# EAGLE schematic AVRI2CIO (EAGLE 6.2)
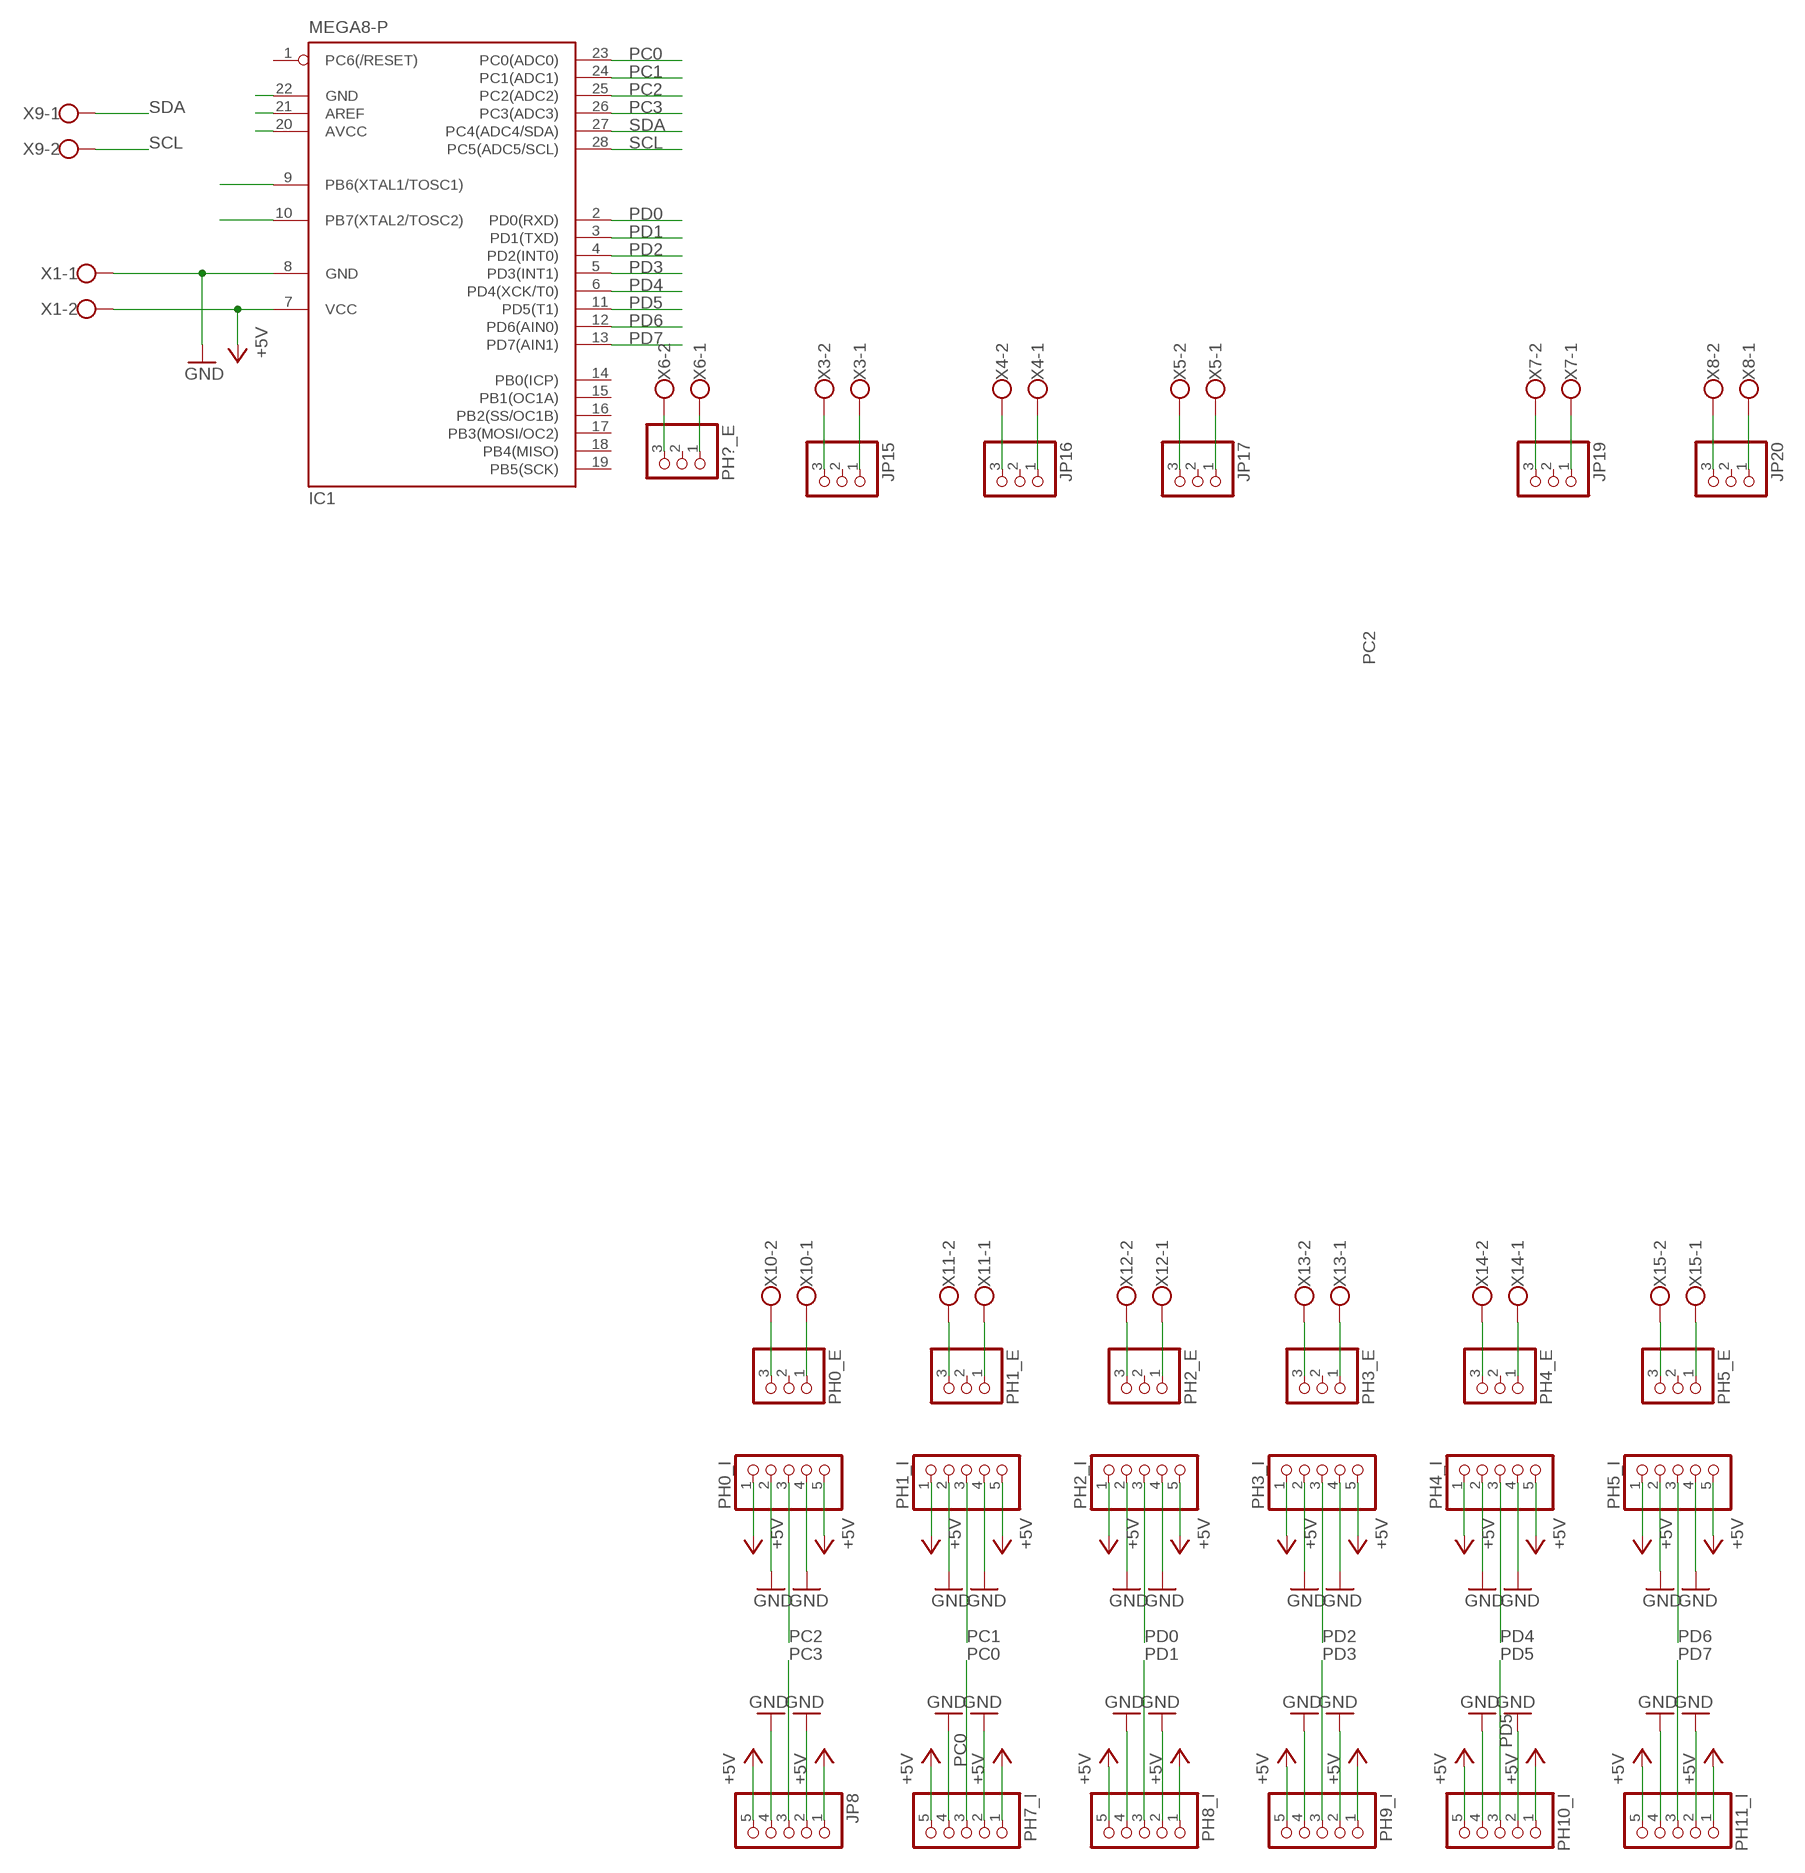
[diagram p0: schematic, sheet 1]

## Parts
IC1  MEGA8-P  [DIL28-3]
JP8  PINHD-1X5  [1X05]
JP15  PINHD-1X3  [1X03]
JP16  PINHD-1X3  [1X03]
JP17  PINHD-1X3  [1X03]
JP19  PINHD-1X3  [1X03]
JP20  PINHD-1X3  [1X03]
PH0_E  PINHD-1X3  [1X03]
PH0_I  PINHD-1X5  [1X05]
PH1_E  PINHD-1X3  [1X03]
PH1_I  PINHD-1X5  [1X05]
PH2_E  PINHD-1X3  [1X03]
PH2_I  PINHD-1X5  [1X05]
PH3_E  PINHD-1X3  [1X03]
PH3_I  PINHD-1X5  [1X05]
PH4_E  PINHD-1X3  [1X03]
PH4_I  PINHD-1X5  [1X05]
PH5_E  PINHD-1X3  [1X03]
PH5_I  PINHD-1X5  [1X05]
PH7_I  PINHD-1X5  [1X05]
PH8_I  PINHD-1X5  [1X05]
PH9_I  PINHD-1X5  [1X05]
PH10_I  PINHD-1X5  [1X05]
PH11_I  PINHD-1X5  [1X05]
PH?_E  PINHD-1X3  [1X03]
X1  W237-102  [W237-102]
X3  W237-102  [W237-102]
X4  W237-102  [W237-102]
X5  W237-102  [W237-102]
X6  W237-102  [W237-102]
X7  W237-102  [W237-102]
X8  W237-102  [W237-102]
X9  W237-102  [W237-102]
X10  W237-102  [W237-102]
X11  W237-102  [W237-102]
X12  W237-102  [W237-102]
X13  W237-102  [W237-102]
X14  W237-102  [W237-102]
X15  W237-102  [W237-102]

## Nets
+5V: IC1.7(VCC) JP8.1 JP8.5 PH0_I.1 PH0_I.5 PH1_I.1 PH1_I.5 PH2_I.1 PH2_I.5 PH3_I.1 PH3_I.5 PH4_I.1 PH4_I.5 PH5_I.1 PH5_I.5 PH7_I.1 PH7_I.5 PH8_I.1 PH8_I.5 PH9_I.1 PH9_I.5 PH10_I.1 PH10_I.5 PH11_I.1 PH11_I.5 X1.2
GND: IC1.8(GND) JP8.2 JP8.4 PH0_I.2 PH0_I.4 PH1_I.2 PH1_I.4 PH2_I.2 PH2_I.4 PH3_I.2 PH3_I.4 PH4_I.2 PH4_I.4 PH5_I.2 PH5_I.4 PH7_I.2 PH7_I.4 PH8_I.2 PH8_I.4 PH9_I.2 PH9_I.4 PH10_I.2 PH10_I.4 PH11_I.2 PH11_I.4 X1.1
IO1: IC1.9(PB6(XTAL1/TOSC1))
IO13: IC1.10(PB7(XTAL2/TOSC2))
N$1: PH0_E.3 X10.2
N$3: JP15.3 X3.2
N$4: JP15.1 X3.1
N$5: JP16.3 X4.2
N$6: JP16.1 X4.1
N$7: JP17.3 X5.2
N$8: JP17.1 X5.1
N$9: PH?_E.3 X6.2
N$10: PH?_E.1 X6.1
N$11: JP19.3 X7.2
N$12: JP19.1 X7.1
N$13: JP20.3 X8.2
N$14: JP20.1 X8.1
N$15: IC1.22(GND)
N$16: IC1.21(AREF)
N$17: PH0_E.1 X10.1
N$19: PH1_E.1 X11.1
N$20: PH1_E.3 X11.2
N$23: PH2_E.1 X12.1
N$24: PH2_E.3 X12.2
N$25: PH3_E.1 X13.1
N$26: PH3_E.3 X13.2
N$27: PH4_E.1 X14.1
N$28: PH4_E.3 X14.2
N$29: PH5_E.1 X15.1
N$30: PH5_E.3 X15.2
N$31: IC1.20(AVCC)
PC0: IC1.23(PC0(ADC0)) PH7_I.3
PC1: IC1.24(PC1(ADC1)) PH1_I.3
PC2: IC1.25(PC2(ADC2)) PH0_I.3
PC3: IC1.26(PC3(ADC3)) JP8.3
PD0: IC1.2(PD0(RXD)) PH2_I.3
PD1: IC1.3(PD1(TXD)) PH8_I.3
PD2: IC1.4(PD2(INT0)) PH3_I.3
PD3: IC1.5(PD3(INT1)) PH9_I.3
PD4: IC1.6(PD4(XCK/T0)) PH4_I.3
PD5: IC1.11(PD5(T1)) PH10_I.3
PD6: IC1.12(PD6(AIN0)) PH5_I.3
PD7: IC1.13(PD7(AIN1)) PH11_I.3
SCL: IC1.28(PC5(ADC5/SCL)) X9.2
SDA: IC1.27(PC4(ADC4/SDA)) X9.1
Unconnected: IC1.1(PC6(/RESET)) IC1.14(PB0(ICP)) IC1.15(PB1(OC1A)) IC1.16(PB2(SS/OC1B)) IC1.17(PB3(MOSI/OC2)) IC1.18(PB4(MISO)) IC1.19(PB5(SCK)) JP15.2 JP16.2 JP17.2 JP19.2 JP20.2 PH0_E.2 PH1_E.2 PH2_E.2 PH3_E.2 PH4_E.2 PH5_E.2 PH?_E.2

## Library data of the parts
IC1 = atmel:MEGA8-P: MICROCONTROLLER 8 Kbytes FLASH, 1 kbytes SRAM, 512 bytes EEPROM, USART, 4-channel 10 bit ADC, 2-channel 8 bit ADC Pin compatible with Atmega48, ATMega88, ATMega168 Source: avr.lbr; OC_FARNELL: unknown; OC_NEWARK: unknown
JP8 PH0_I PH1_I PH2_I PH3_I PH4_I PH5_I PH7_I PH8_I PH9_I PH10_I PH11_I = pinhead:PINHD-1X5: PIN HEADER
JP15-JP17 JP19 JP20 PH0_E PH1_E PH2_E PH3_E PH4_E PH5_E PH?_E = pinhead:PINHD-1X3: PIN HEADER
X1 X3-X15 = con-wago-500:W237-102: WAGO SCREW CLAMP; MPN: 237-102; OC_FARNELL: unknown; OC_NEWARK: 70K9898